# Altium project Bai_mo_đau.PrjPcb
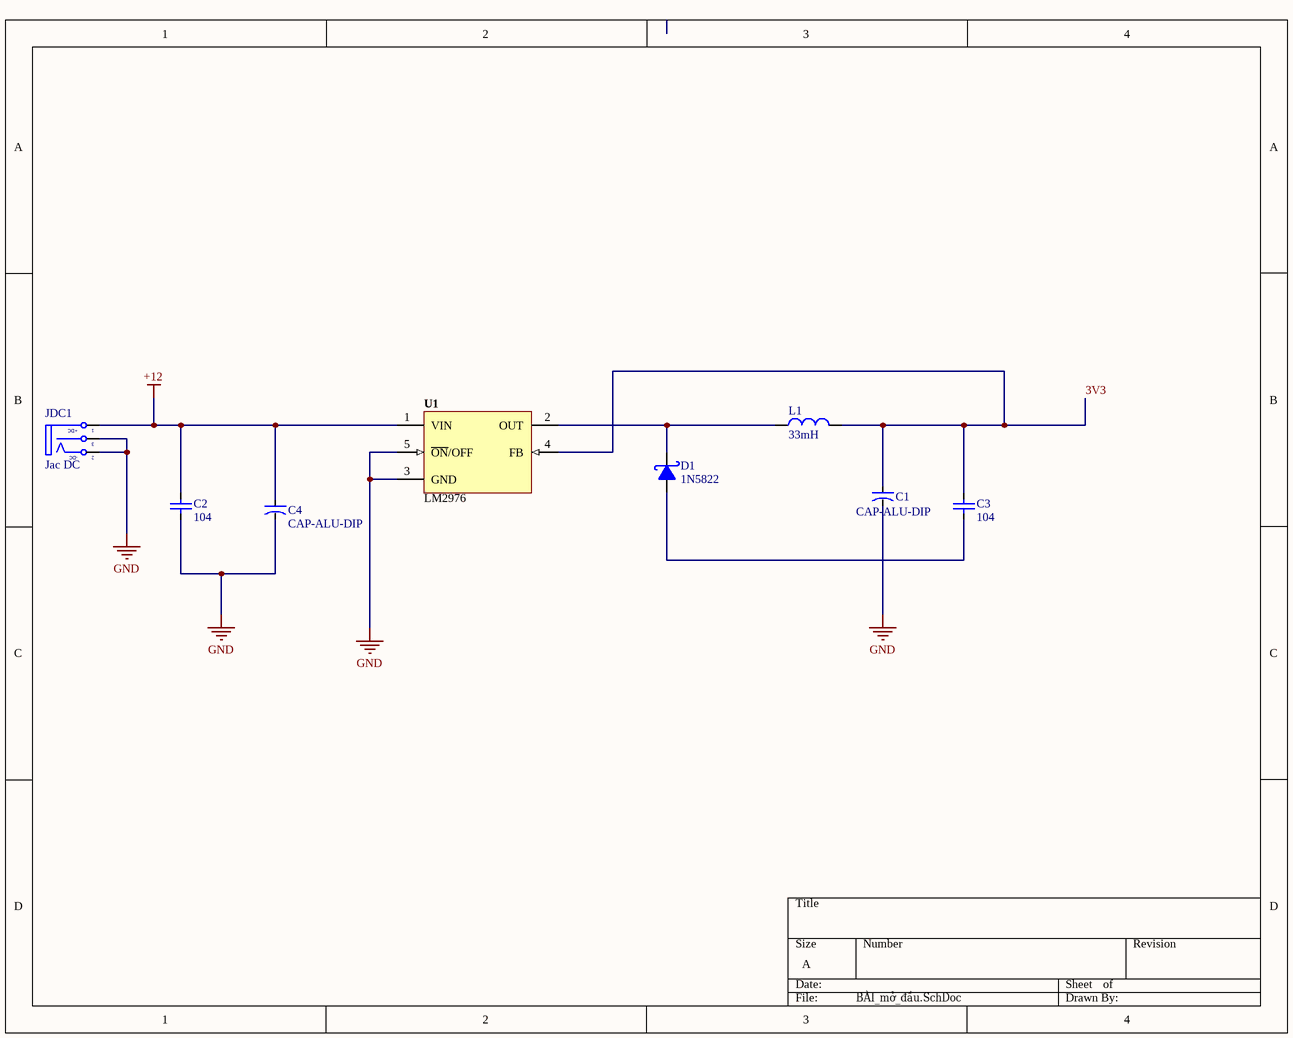
[diagram p0: BÀI_mở_đầu.SchDoc]
1 sheet, 8 parts. Net scope: global (net labels, ports and power ports of the same name join across sheets).
Board file: main.PcbDoc

## Sheet BÀI_mở_đầu.SchDoc
size A; SheetNumber: 1; SheetTotal: 1

### Parts
C1  CAP-ALU-DIP  [CA-ALU-2.54]
C2  104  [CAP_0805]
C3  104  [CAP_0805]
C4  CAP-ALU-DIP  [CA-ALU-2.54]
D1  1N5822  [SMA]
JDC1  Jac DC  [DC-IN]
L1  33mH  [L-SMD-M-12x10]
U1  LM2976  [TO263-5]

### Nets
+12: C2.2 C4.1 JDC1.1(T) U1.1(VIN)
GND: C1.2 C2.1 C4.2 JDC1.2(TN) JDC1.3(S) U1.3(GND) U1.5(~{ON}/OFF)
3V3: C1.1 C3.2 L1.2 U1.4(FB)
NetC3_1: C3.1 D1.1(A)
NetD1_2: D1.2(K) L1.1 U1.2(OUT)

### Notes on the sheet
- (in symbol DCIN) +DC; -DC

### Library data of the parts
C1 C4 = CAP-ALU-DIP: Capacitor (Semiconductor SIM Model); Value: 104; LatestRevisionDate: 17-Jul-2002; LatestRevisionNote: Re-released for DXP Platform.; PackageReference: C1206; Publisher: Altium Limited
C2 C3 = CapSMD: Capacitor; Value: 33p; Published: 8-Jun-2000; LatestRevisionDate: 17-Jul-2002; LatestRevisionNote: Re-released for DXP Platform.; PackageReference: RAD-0.3; Publisher: Altium Limited
D1 = 1N5822: Schottky Rectifiers; Value: Diode c?m 1N5408
JDC1 = DCIN: Jac DC input; Value: Jac DC
L1 = Inductor: Value: 150 mH
U1 = LM2596: Max Input Voltage: 12 V; Max Output Current: 3 (6.0 peak) A; Max Output Voltage: mV; Category: IC-Power; Min Input Voltage: mV; Min Output Voltage: mV; Mounting Technology: Surface Mount; Status: Unreleased; Supply Voltage: mV; Temperature Range: -40 to +125 degC